# EAGLE schematic Hw6_Schema (EAGLE 9.6.2)
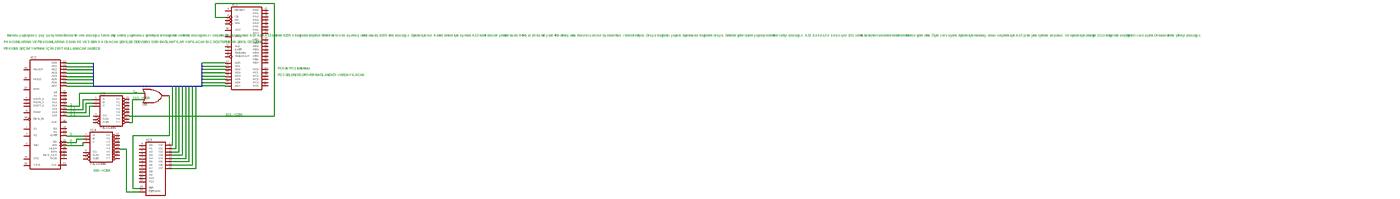
[diagram p0: schematic, sheet 1, overview]
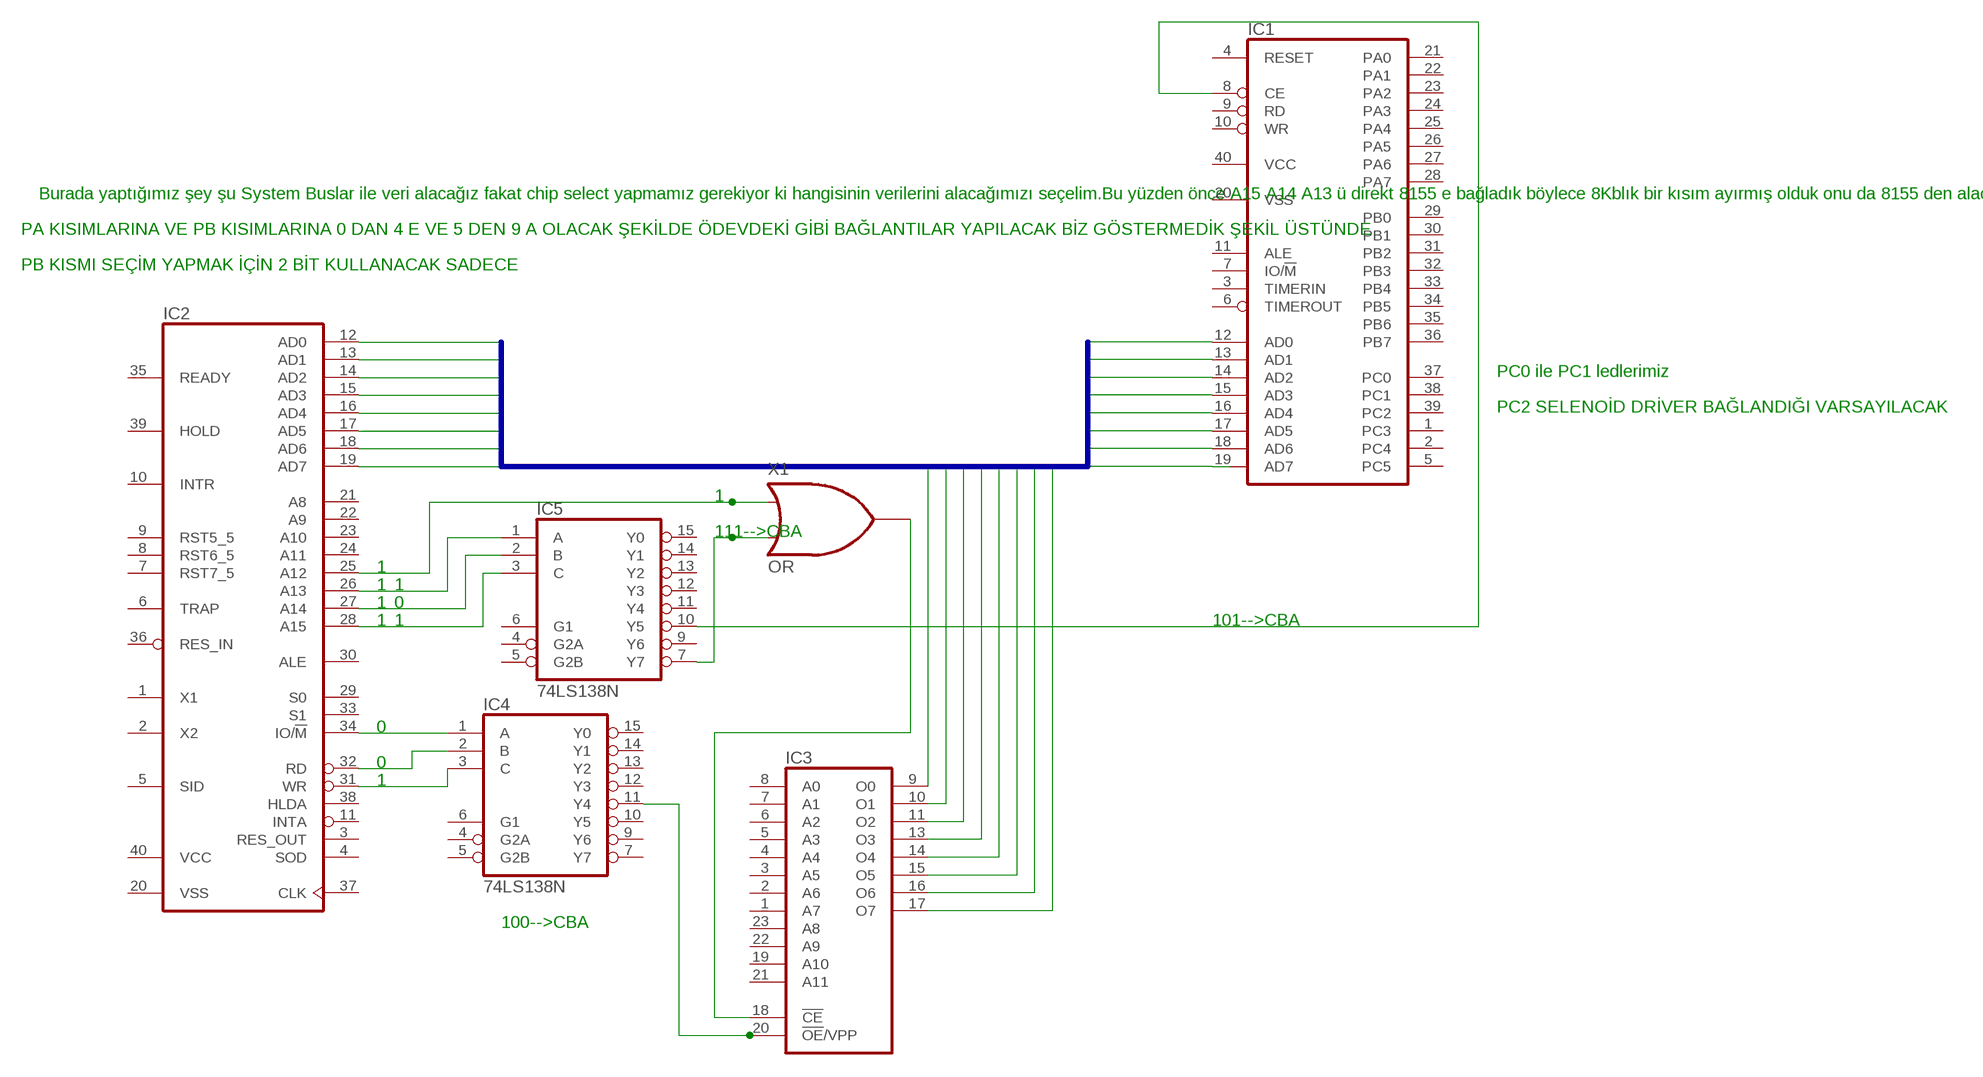
[diagram p1: schematic, sheet 1, part 1 of 4]
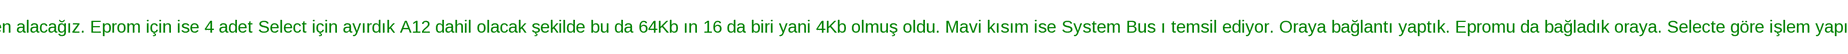
[diagram p2: schematic, sheet 1, part 2 of 4]
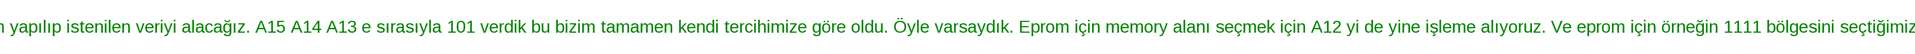
[diagram p3: schematic, sheet 1, part 3 of 4]
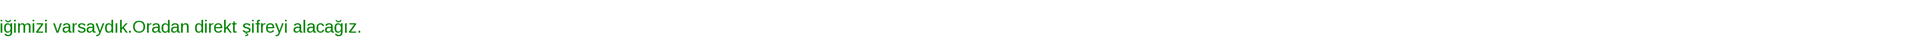
[diagram p4: schematic, sheet 1, part 4 of 4]

## Parts
IC1  8155  [DIL40]
IC2  8085  [DIL40]
IC3  2732  [DIL24]
IC4  74LS138N  [DIL16]
IC5  74LS138N  [DIL16]
X1  OR  (no package)

## Nets
B$1: IC1.12(AD0) IC1.13(AD1) IC1.14(AD2) IC1.15(AD3) IC1.16(AD4) IC1.17(AD5) IC1.18(AD6) IC2.12(AD0) IC2.13(AD1) IC2.14(AD2) IC2.15(AD3) IC2.16(AD4) IC2.17(AD5) IC2.18(AD6) IC2.19(AD7) IC3.9(O0) IC3.10(O1) IC3.11(O2) IC3.13(O3) IC3.14(O4) IC3.15(O5) IC3.16(O6) IC3.17(O7)
N$1: IC1.19(AD7)
N$2: IC2.34(IO/!M) IC4.1(A)
N$3: IC2.32(RD) IC4.2(B)
N$4: IC2.31(WR) IC4.3(C)
N$5: IC3.20(!OE!/VPP) IC4.11(Y4)
N$6: IC2.28(A15) IC5.3(C)
N$7: IC2.27(A14) IC5.2(B)
N$8: IC2.26(A13) IC5.1(A)
N$9: IC2.25(A12) X1.A
N$10: IC1.8(CE) IC5.10(Y5)
N$11: IC3.18(!CE) X1.Y
N$13: IC5.7(Y7) X1.B
Unconnected: IC1.1(PC3) IC1.2(PC4) IC1.3(TIMERIN) IC1.4(RESET) IC1.5(PC5) IC1.6(TIMEROUT) IC1.7(IO/!M) IC1.9(RD) IC1.10(WR) IC1.11(ALE) IC1.21(PA0) IC1.22(PA1) IC1.23(PA2) IC1.24(PA3) IC1.25(PA4) IC1.26(PA5) IC1.27(PA6) IC1.28(PA7) IC1.29(PB0) IC1.30(PB1) IC1.31(PB2) IC1.32(PB3) IC1.33(PB4) IC1.34(PB5) IC1.35(PB6) IC1.36(PB7) IC1.37(PC0) IC1.38(PC1) IC1.39(PC2) IC2.1(X1) IC2.2(X2) IC2.3(RES_OUT) IC2.4(SOD) IC2.5(SID) IC2.6(TRAP) IC2.7(RST7_5) IC2.8(RST6_5) IC2.9(RST5_5) IC2.10(INTR) IC2.11(INTA) IC2.21(A8) IC2.22(A9) IC2.23(A10) IC2.24(A11) IC2.29(S0) IC2.30(ALE) IC2.33(S1) IC2.35(READY) IC2.36(RES_IN) IC2.37(CLK) IC2.38(HLDA) IC2.39(HOLD) IC3.1(A7) IC3.2(A6) IC3.3(A5) IC3.4(A4) IC3.5(A3) IC3.6(A2) IC3.7(A1) IC3.8(A0) IC3.19(A10) IC3.21(A11) IC3.22(A9) IC3.23(A8) IC4.4(G2A) IC4.5(G2B) IC4.6(G1) IC4.7(Y7) IC4.9(Y6) IC4.10(Y5) IC4.12(Y3) IC4.13(Y2) IC4.14(Y1) IC4.15(Y0) IC5.4(G2A) IC5.5(G2B) IC5.6(G1) IC5.9(Y6) IC5.11(Y4) IC5.12(Y3) IC5.13(Y2) IC5.14(Y1) IC5.15(Y0)

## Buses
B$1

## Notes on the sheet
- Burada yaptığımız şey şu System Buslar ile veri alacağız fakat chip select yapmamız gerekiyor ki hangisinin verilerini alacağımızı seçelim.Bu yüzden önce A15 A14 A13 ü direkt 8155 e bağladık böylece 8Kblık bir kısım ayırmış olduk onu da 8155 den alacağız. Eprom için ise 4 adet Select için ayırdık A12 dahil olacak şekilde bu da 64Kb ın 16 da biri yani 4Kb olmuş oldu. Mavi kısım ise System Bus ı temsil ediyor. Oraya bağlantı yaptık. Epromu da bağladık oraya. Selecte göre işlem yapılıp istenilen veriyi alacağız. A15 A14 A13 e sırasıyla 101 verdik bu bizim tamamen kendi tercihimize göre oldu. Öyle varsaydık. Eprom için memory alanı seçmek için A12 yi de yine işleme alıyoruz. Ve eprom için örneğin 1111 bölgesini seçtiğimizi varsaydık.Oradan direkt şifreyi alacağız.
- PA KISIMLARINA VE PB KISIMLARINA 0 DAN 4 E VE 5 DEN 9 A OLACAK ŞEKİLDE ÖDEVDEKİ GİBİ BAĞLANTILAR YAPILACAK BİZ GÖSTERMEDİK ŞEKİL ÜSTÜNDE
- PB KISMI SEÇİM YAPMAK İÇİN 2 BİT KULLANACAK SADECE
- PC0 ile PC1 ledlerimiz
- PC2 SELENOİD DRİVER BAĞLANDIĞI VARSAYILACAK
- 1
- 111-->CBA
- 1
- 1 | 1
- 1 | 0
- 1 | 1 | 101-->CBA
- 0
- 0
- 1
- 100-->CBA

## Power pins joined to a net without a drawn wire
GND: IC3.12(GND) IC4.8(GND) IC5.8(GND)
VCC: IC1.40(VCC) IC2.40(VCC) IC3.24(VCC) IC4.16(VCC) IC5.16(VCC)
VSS: IC1.20(VSS) IC2.20(VSS)

## Library data of the parts
IC1 = micro-intel:8155: MICROCOMPUTER/PERIPHERAL DEVICE; OC_FARNELL: unknown; OC_NEWARK: unknown
IC2 = micro-intel:8085: MICROCOMPUTER/PERIPHERAL DEVICE; OC_FARNELL: unknown; OC_NEWARK: unknown
IC3 = memory:2732: MEMORY
IC4 = 74xx-us:74*138: 3-line to 8-line DECODER/DEMULTIPLEXER
IC5 = 74xx-eu:74*138: 3-line to 8-line DECODER/DEMULTIPLEXER
X1 = ngspice-digital:OR: 2 input logic OR gate